# EAGLE design midihub_2 (EAGLE 5.10)

## Sheet 1 of 6
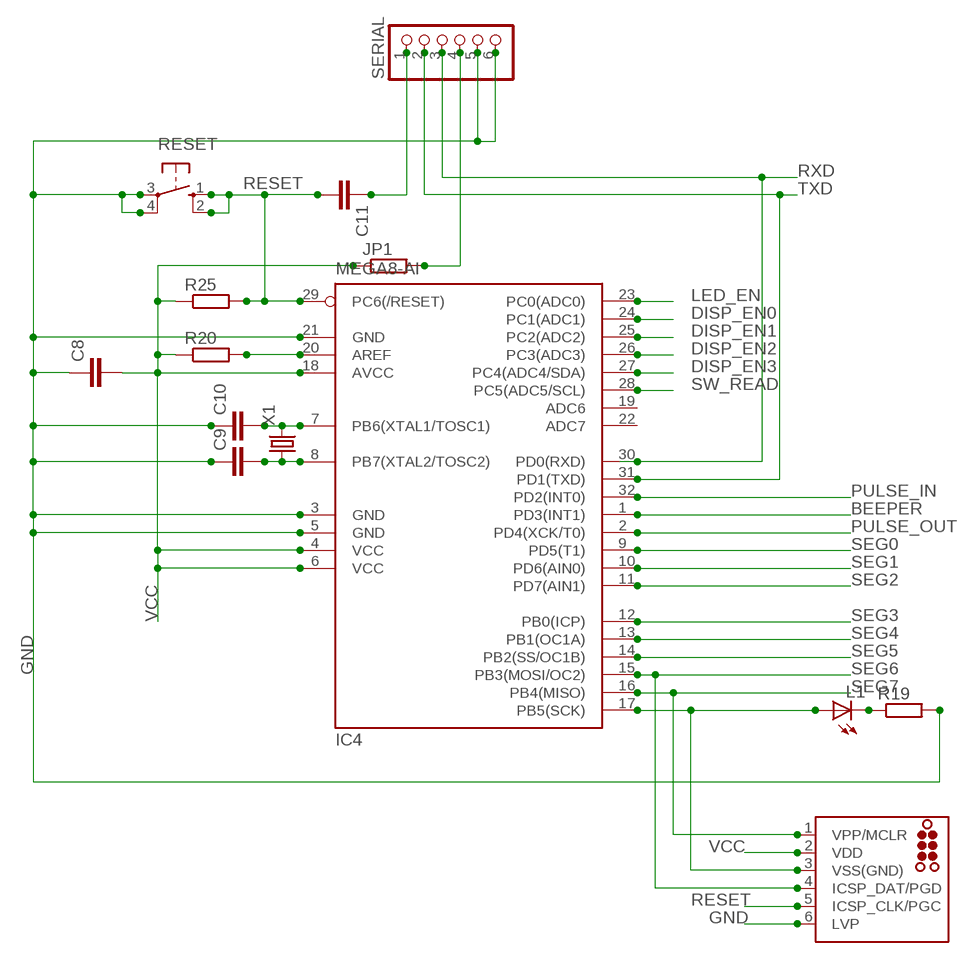
[diagram p0: schematic, sheet 1]

### Parts
C8  C-EUC0805  [C0805]
C9  C-EUC0805  [C0805]
C10  C-EUC0805  [C0805]
C11  C-EUC0805  [C0805]
IC4  MEGA8-AI  [TQFP32-08]
ICSP  TC2030-MCP-NL  [TC2030-MCP-NL]
JP1  R-EU_M0805  [M0805]
L1  LED3MM  [LED3MM]
R19  R-EU_M0805  [M0805]
R20  R-EU_M0805  [M0805]
R25  R-EU_M0805  [M0805]
RESET  10-XX  [B3F-10XX]
SERIAL  PINHD-1X6  [1X06]
X1  CRYSTALHC49S  [HC49/S]

### Nets
BEEPER: IC4.1(PD3(INT1)) ; also sheet 6
DISP_EN0: IC4.24(PC1(ADC1)) ; also sheet 3
DISP_EN1: IC4.25(PC2(ADC2)) ; also sheet 3
DISP_EN2: IC4.26(PC3(ADC3)) ; also sheet 3
DISP_EN3: IC4.27(PC4(ADC4/SDA)) ; also sheet 3
GND: C8.1 C9.1 C10.1 IC4.3(GND) IC4.5(GND) IC4.21(GND) ICSP.6(LVP) R19.2 RESET.3(P) RESET.4(P1) SERIAL.5 SERIAL.6 ; also sheet 2,3,4,5,6
LED_EN: IC4.23(PC0(ADC0)) ; also sheet 3
N$2: JP1.2 SERIAL.4
N$25: L1.K(C) R19.1
N$26: IC4.17(PB5(SCK)) ICSP.3(VSS(GND)) L1.A
N$33: C10.2 IC4.7(PB6(XTAL1/TOSC1)) X1.2
N$34: C9.2 IC4.8(PB7(XTAL2/TOSC2)) X1.1
N$35: IC4.20(AREF) R20.2
N$39: C11.1 SERIAL.1
PULSE_IN: IC4.32(PD2(INT0)) ; also sheet 4
PULSE_OUT: IC4.2(PD4(XCK/T0)) ; also sheet 4
RESET: C11.2 IC4.29(PC6(/RESET)) ICSP.5(ICSP_CLK/PGC) R25.2 RESET.1(S) RESET.2(S1)
RXD: IC4.30(PD0(RXD)) SERIAL.3 ; also sheet 2
SEG0: IC4.9(PD5(T1)) ; also sheet 3
SEG1: IC4.10(PD6(AIN0)) ; also sheet 3
SEG2: IC4.11(PD7(AIN1)) ; also sheet 3
SEG3: IC4.12(PB0(ICP)) ; also sheet 3
SEG4: IC4.13(PB1(OC1A)) ; also sheet 3
SEG5: IC4.14(PB2(SS/OC1B)) ; also sheet 3
SEG6: IC4.15(PB3(MOSI/OC2)) ICSP.4(ICSP_DAT/PGD) ; also sheet 3
SEG7: IC4.16(PB4(MISO)) ICSP.1(VPP/MCLR) ; also sheet 3
SW_READ: IC4.28(PC5(ADC5/SCL)) ; also sheet 3
TXD: IC4.31(PD1(TXD)) SERIAL.2 ; also sheet 2
VCC: C8.2 IC4.4(VCC) IC4.6(VCC) IC4.18(AVCC) ICSP.2(VDD) JP1.1 R20.1 R25.1 ; also sheet 2,4,5
Unconnected: IC4.19(ADC6) IC4.22(ADC7)

## Sheet 2 of 6
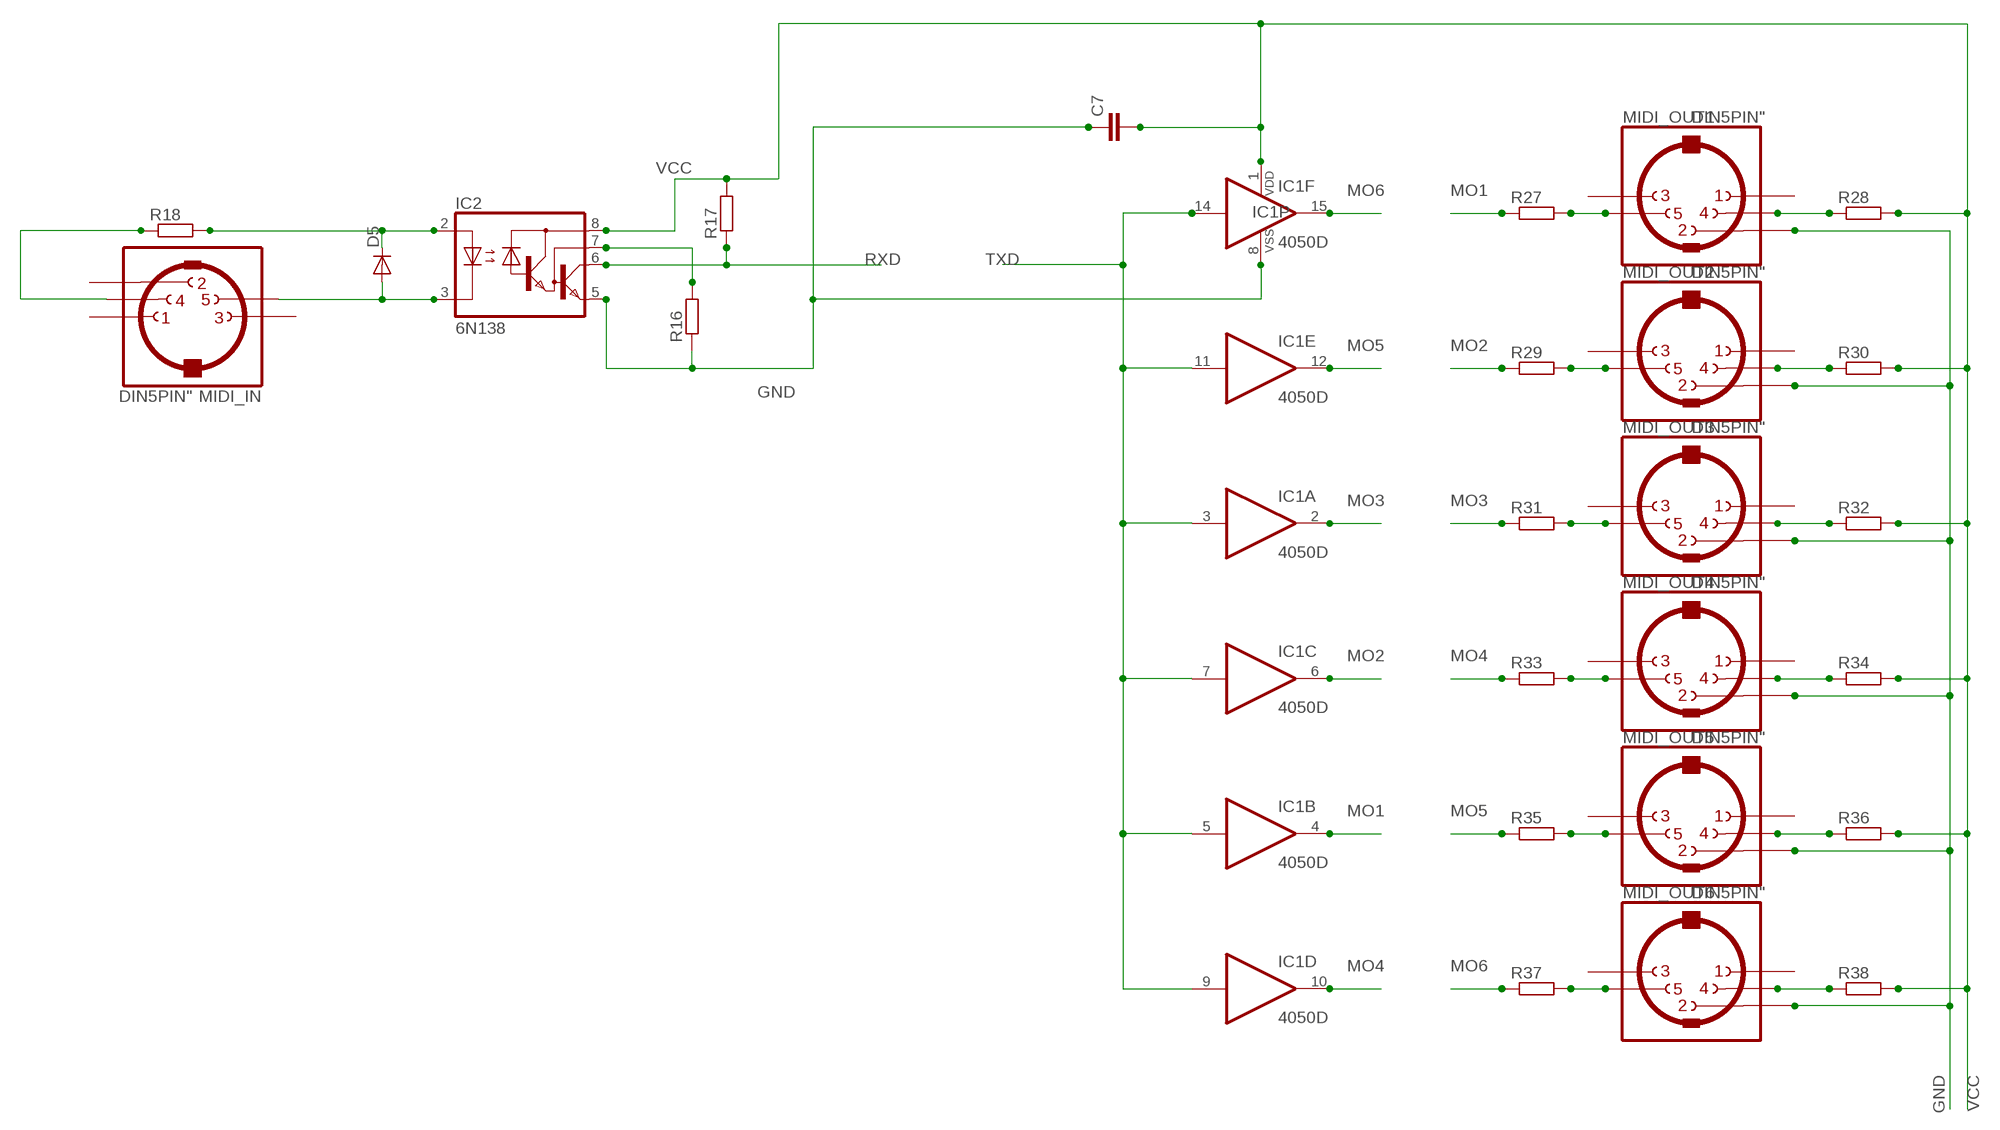
[diagram p1: schematic, sheet 2]

### Parts
C7  C-EUC0805  [C0805]
D5  DIODE-SOD80C  [SOD80C]
IC1  4050D  [SO16]
IC2  6N138  [DIL08]
MIDI_IN  DIN5PIN"  DIN5PINRAPIDDIN5  [RAPIDDIN5]
MIDI_OUT1  DIN5PIN"  DIN5PINRAPIDDIN5  [RAPIDDIN5]
MIDI_OUT2  DIN5PIN"  DIN5PINRAPIDDIN5  [RAPIDDIN5]
MIDI_OUT3  DIN5PIN"  DIN5PINRAPIDDIN5  [RAPIDDIN5]
MIDI_OUT4  DIN5PIN"  DIN5PINRAPIDDIN5  [RAPIDDIN5]
MIDI_OUT5  DIN5PIN"  DIN5PINRAPIDDIN5  [RAPIDDIN5]
MIDI_OUT6  DIN5PIN"  DIN5PINRAPIDDIN5  [RAPIDDIN5]
R16  R-EU_M0805  [M0805]
R17  R-EU_M0805  [M0805]
R18  R-EU_M0805  [M0805]
R27  R-EU_M0805  [M0805]
R28  R-EU_M0805  [M0805]
R29  R-EU_M0805  [M0805]
R30  R-EU_M0805  [M0805]
R31  R-EU_M0805  [M0805]
R32  R-EU_M0805  [M0805]
R33  R-EU_M0805  [M0805]
R34  R-EU_M0805  [M0805]
R35  R-EU_M0805  [M0805]
R36  R-EU_M0805  [M0805]
R37  R-EU_M0805  [M0805]
R38  R-EU_M0805  [M0805]

### Nets
GND: C7.1 IC1.8(P:VSS) IC2.5(GND) MIDI_OUT1.2 MIDI_OUT2.2 MIDI_OUT3.2 MIDI_OUT4.2 MIDI_OUT5.2 MIDI_OUT6.2 R16.1 ; also sheet 1,3,4,5,6
MO1: IC1.4(B:O) R27.1
MO2: IC1.6(C:O) R29.1
MO3: IC1.2(A:O) R31.1
MO4: IC1.10(D:O) R33.1
MO5: IC1.12(E:O) R35.1
MO6: IC1.15(F:O) R37.1
N$7: MIDI_OUT1.5 R27.2
N$8: MIDI_OUT2.5 R29.2
N$9: MIDI_OUT3.5 R31.2
N$10: MIDI_OUT4.5 R33.2
N$11: MIDI_OUT5.5 R35.2
N$12: MIDI_OUT6.5 R37.2
N$13: MIDI_OUT1.4 R28.1
N$14: MIDI_OUT2.4 R30.1
N$15: MIDI_OUT3.4 R32.1
N$16: MIDI_OUT4.4 R34.1
N$17: MIDI_OUT5.4 R36.1
N$18: MIDI_OUT6.4 R38.1
N$41: D5.A IC2.3(C) MIDI_IN.5
N$42: MIDI_IN.4 R18.1
N$43: D5.C IC2.2(A) R18.2
N$46: IC2.7(VB) R16.2
RXD: IC2.6(VO) R17.1 ; also sheet 1
TXD: IC1.3(A:I) IC1.5(B:I) IC1.7(C:I) IC1.9(D:I) IC1.11(E:I) IC1.14(F:I) ; also sheet 1
VCC: C7.2 IC1.1(P:VDD) IC2.8(VCC) R17.2 R28.2 R30.2 R32.2 R34.2 R36.2 R38.2 ; also sheet 1,4,5
Unconnected: MIDI_IN.1 MIDI_IN.2 MIDI_IN.3 MIDI_OUT1.1 MIDI_OUT1.3 MIDI_OUT2.1 MIDI_OUT2.3 MIDI_OUT3.1 MIDI_OUT3.3 MIDI_OUT4.1 MIDI_OUT4.3 MIDI_OUT5.1 MIDI_OUT5.3 MIDI_OUT6.1 MIDI_OUT6.3

## Sheet 3 of 6
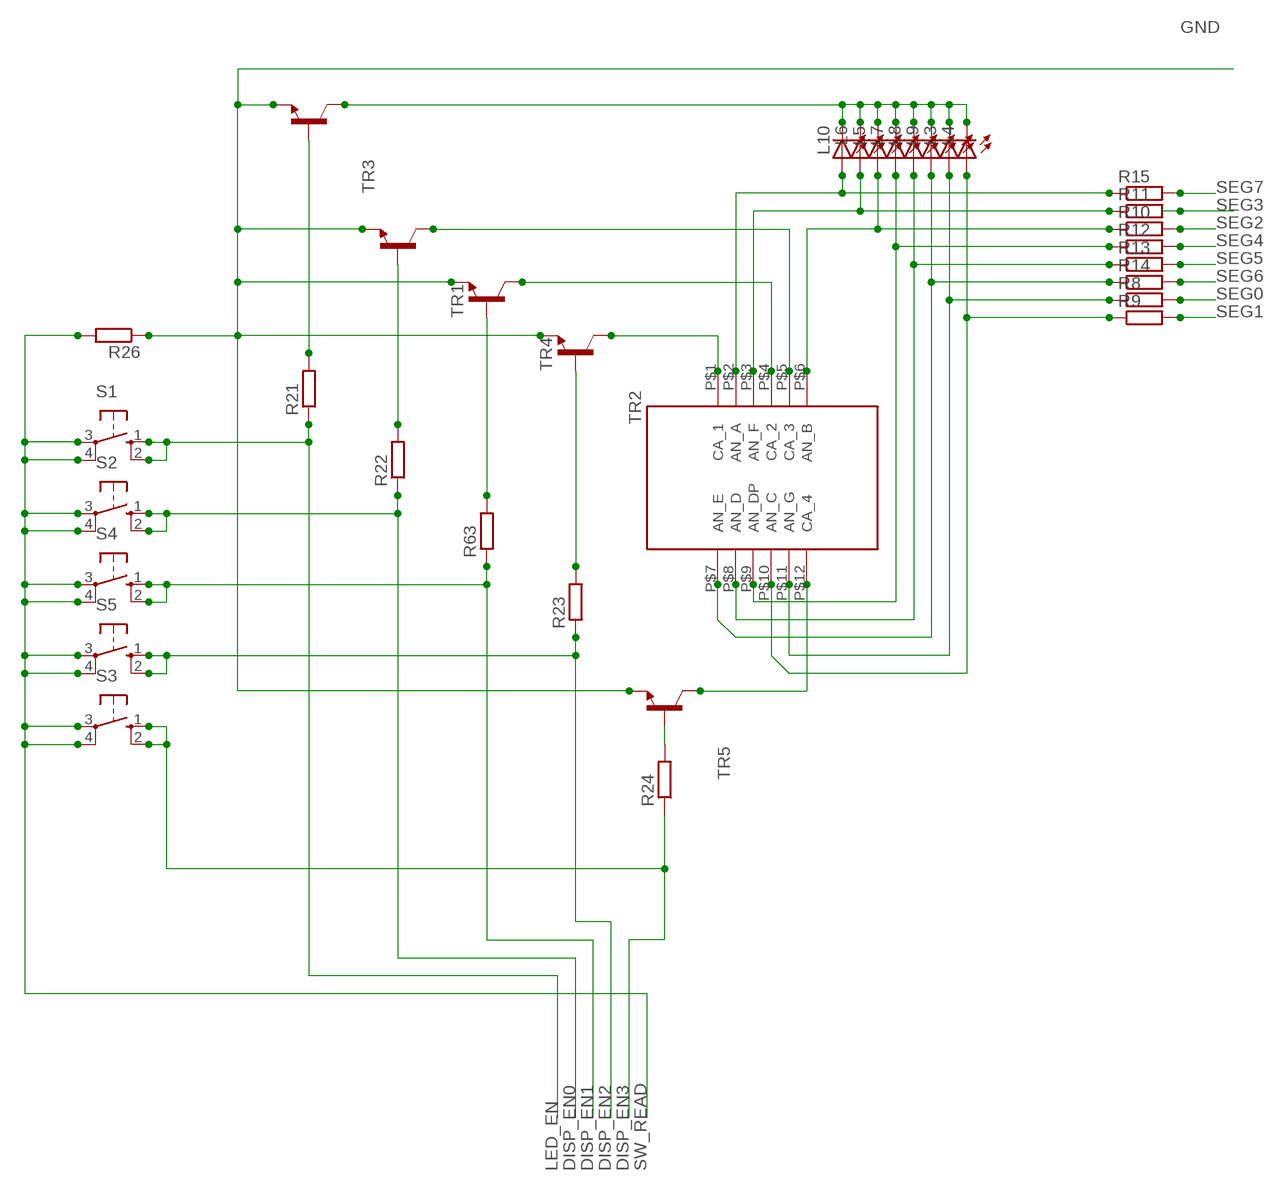
[diagram p2: schematic, sheet 3]

### Parts
DISP1  QUAD7SEG  [QUAD7SEG]
L3  LED3MM  [LED3MM]
L4  LED3MM  [LED3MM]
L5  LED3MM  [LED3MM]
L6  LED3MM  [LED3MM]
L7  LED3MM  [LED3MM]
L8  LED3MM  [LED3MM]
L9  LED3MM  [LED3MM]
L10  LED3MM  [LED3MM]
R8  R-EU_M0805  [M0805]
R9  R-EU_M0805  [M0805]
R10  R-EU_M0805  [M0805]
R11  R-EU_M0805  [M0805]
R12  R-EU_M0805  [M0805]
R13  R-EU_M0805  [M0805]
R14  R-EU_M0805  [M0805]
R15  R-EU_R0805  [R0805]
R21  R-EU_M0805  [M0805]
R22  R-EU_M0805  [M0805]
R23  R-EU_M0805  [M0805]
R24  R-EU_M0805  [M0805]
R26  R-EU_M0805  [M0805]
R63  R-EU_M0805  [M0805]
S1  40-XX  [B3F-40XX]
S2  40-XX  [B3F-40XX]
S3  40-XX  [B3F-40XX]
S4  40-XX  [B3F-40XX]
S5  40-XX  [B3F-40XX]
TR1  MMBT3904LT1-NPN-SOT23-BEC  [SOT23-BEC]
TR2  MMBT3904LT1-NPN-SOT23-BEC  [SOT23-BEC]
TR3  MMBT3904LT1-NPN-SOT23-BEC  [SOT23-BEC]
TR4  MMBT3904LT1-NPN-SOT23-BEC  [SOT23-BEC]
TR5  MMBT3904LT1-NPN-SOT23-BEC  [SOT23-BEC]

### Nets
DISP_EN0: R22.1 S2.1(S) S2.2(S1) ; also sheet 1
DISP_EN1: R63.1 S4.1(S) S4.2(S1) ; also sheet 1
DISP_EN2: R23.1 S5.1(S) S5.2(S1) ; also sheet 1
DISP_EN3: R24.1 S3.1(S) S3.2(S1) ; also sheet 1
GND: R26.1 TR1.E TR2.E TR3.E TR4.E TR5.E ; also sheet 1,2,4,5,6
LED_EN: R21.1 S1.1(S) S1.2(S1) ; also sheet 1
N$52: DISP1.P$2(AN_A) L10.A R15.1
N$53: DISP1.P$3(AN_F) L6.A R11.1
N$54: DISP1.P$6(AN_B) L5.A R10.1
N$55: DISP1.P$9(AN_DP) L7.A R12.1
N$56: DISP1.P$8(AN_D) L8.A R13.1
N$57: DISP1.P$7(AN_E) L9.A R14.1
N$58: DISP1.P$11(AN_G) L3.A R8.1
N$59: DISP1.P$10(AN_C) L4.A R9.1
N$60: L3.K(C) L4.K(C) L5.K(C) L6.K(C) L7.K(C) L8.K(C) L9.K(C) L10.K(C) TR3.C
N$61: DISP1.P$1(CA_1) TR2.C
N$62: DISP1.P$4(CA_2) TR4.C
N$63: DISP1.P$5(CA_3) TR1.C
N$64: DISP1.P$12(CA_4) TR5.C
N$65: R21.2 TR3.B
N$66: R22.2 TR1.B
N$67: R63.2 TR4.B
N$68: R23.2 TR2.B
N$74: R24.2 TR5.B
SEG0: R8.2 ; also sheet 1
SEG1: R9.2 ; also sheet 1
SEG2: R10.2 ; also sheet 1
SEG3: R11.2 ; also sheet 1
SEG4: R12.2 ; also sheet 1
SEG5: R13.2 ; also sheet 1
SEG6: R14.2 ; also sheet 1
SEG7: R15.2 ; also sheet 1
SW_READ: R26.2 S1.3(P) S1.4(P1) S2.3(P) S2.4(P1) S3.3(P) S3.4(P1) S4.3(P) S4.4(P1) S5.3(P) S5.4(P1) ; also sheet 1

## Sheet 4 of 6
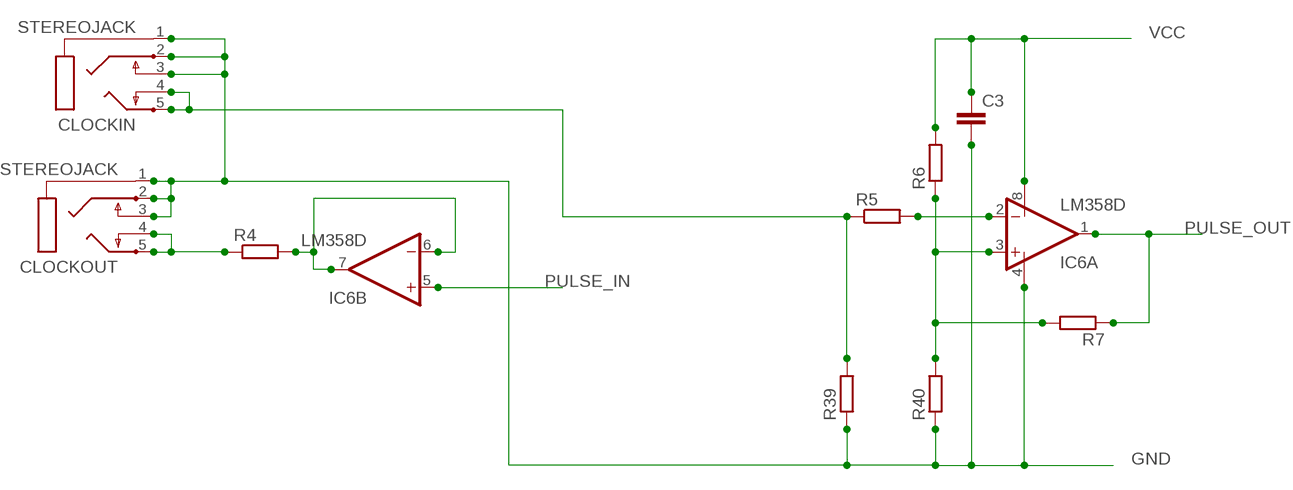
[diagram p3: schematic, sheet 4]

### Parts
C3  C-EUC0805  [C0805]
CLOCKIN  STEREOJACK  [STX3100]
CLOCKOUT  STEREOJACK  [STX3100]
IC6  LM358D  [SO08]
R4  R-EU_M0805  [M0805]
R5  R-EU_M0805  [M0805]
R6  R-EU_M0805  [M0805]
R7  R-EU_M0805  [M0805]
R39  R-EU_M0805  [M0805]
R40  R-EU_M0805  [M0805]

### Nets
GND: C3.2 CLOCKIN.1 CLOCKIN.2 CLOCKIN.3 CLOCKOUT.1 CLOCKOUT.2 CLOCKOUT.3 IC6.4(P:V-) R39.1 R40.1 ; also sheet 1,2,3,5,6
N$19: IC6.3(A:+IN) R6.1 R7.2 R40.2
N$21: IC6.2(A:-IN) R5.2
N$22: CLOCKIN.4 CLOCKIN.5 R5.1 R39.2
N$23: CLOCKOUT.4 CLOCKOUT.5 R4.1
N$24: IC6.6(B:-IN) IC6.7(B:OUT) R4.2
PULSE_IN: IC6.5(B:+IN) ; also sheet 1
PULSE_OUT: IC6.1(A:OUT) R7.1 ; also sheet 1
VCC: C3.1 IC6.8(P:V+) R6.2 ; also sheet 1,2,5

## Sheet 5 of 6
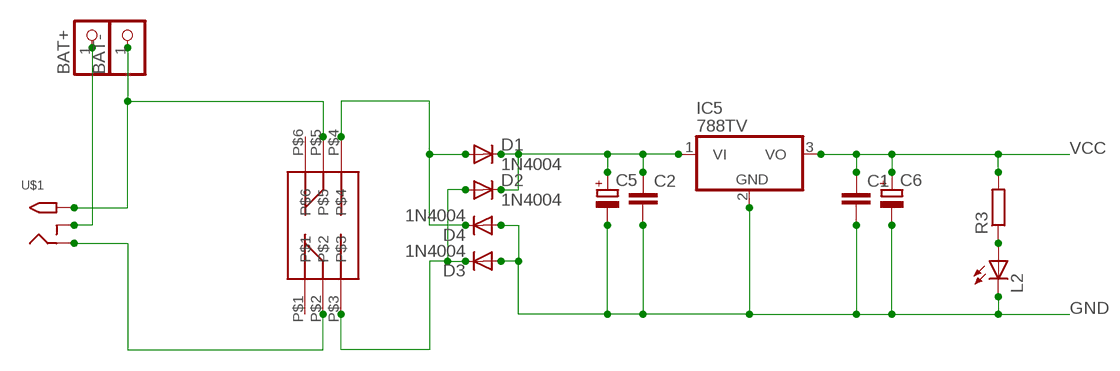
[diagram p4: schematic, sheet 5]

### Parts
BAT+  PINHD-1X1  [1X01]
BAT-  PINHD-1X1  [1X01]
C1  C-EUC0805  [C0805]
C2  C-EUC0805  [C0805]
C5  CPOL-EUE2.5-6  [E2,5-6]
C6  CPOL-EUE2.5-6  [E2,5-6]
D1  1N4004  [DO-VERT]
D2  1N4004  [DO-VERT]
D3  1N4004  [DO-VERT]
D4  1N4004  [DO-VERT]
IC5  788TV  [TO220V]
L2  LED3MM  [LED3MM]
R3  R-EU_M0805  [M0805]
U$1  2.1MMJACKTHM  [PJ-102A]
U$2  2P2T_LATCHING  [2P2T_LATCHING]

### Nets
GND: C1.2 C2.2 C5.- C6.- D3.A D4.A IC5.2(GND) L2.K(C) ; also sheet 1,2,3,4,6
N$1: BAT+.1 U$1.RING_SW
N$20: C2.1 C5.+ D1.C D2.C IC5.1(VI)
N$27: L2.A R3.1
N$28: BAT-.1 U$1.TIP U$2.P$5
N$29: D1.A D4.C U$2.P$4
N$30: D2.A D3.C U$2.P$3
N$31: U$1.RING U$2.P$2
VCC: C1.1 C6.+ IC5.3(VO) R3.2 ; also sheet 1,2,4
Unconnected: U$2.P$1 U$2.P$6

## Sheet 6 of 6
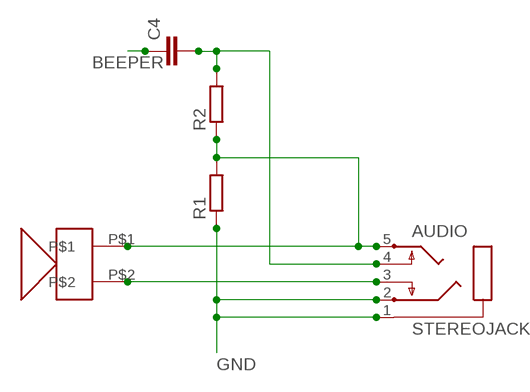
[diagram p5: schematic, sheet 6]

### Parts
AUDIO  STEREOJACK  [STX3100]
C4  C-EUC0805  [C0805]
R1  R-EU_M0805  [M0805]
R2  R-EU_M0805  [M0805]
U$3  THRUHOLEBEEPER  [THRUHOLEBEEPER]

### Nets
BEEPER: C4.1 ; also sheet 1
GND: AUDIO.1 AUDIO.2 R1.1 ; also sheet 1,2,3,4,5
N$36: AUDIO.5 R1.2 R2.1 U$3.P$1
N$37: AUDIO.4 C4.2 R2.2
N$40: AUDIO.3 U$3.P$2

## Library data of the parts
AUDIO CLOCKIN CLOCKOUT = adafruit:STEREOJACK: MIC/HEADPHONE JACK Stereo jack with two switches. Kycon STX3100, CUI SJ1-3555NG and/or 4UCon 05544
BAT+ BAT- = pinhead:PINHD-1X1: PIN HEADER
C1-C3 C7-C11 = rcl:C-EU: CAPACITOR, European symbol
C4 = resistor:C-EU: CAPACITOR, European symbol
C5 C6 = rcl:CPOL-EU: POLARIZED CAPACITOR, European symbol
D1-D4 = jasons_stuff:1N4004: DIODE general purpose rectifier, 1 A
D5 = diode:DIODE-: DIODE
DISP1 = jasons_stuff:QUAD7SEG
IC1 = 40xx:4050: Hex non-inverting BUFFER
IC2 = optocoupler:6N138: MOTOROLA OPTO COUPLER
IC4 = atmel:MEGA8: MICROCONTROLLER 8 Kbytes FLASH, 1 kbytes SRAM, 512 bytes EEPROM, USART, 6-channel 10 bit ADC, 2-channel 8 bit ADC Pin compatible with Atmega48, ATMega88, ATMega168 Source: avr.lbr
IC5 = linear:78*: Positive VOLTAGE REGULATOR Source: http://cache.national.com/ds/LM/LM78L05.pdf http://www.fairchildsemi.com/ds/LM/LM7805.pdf
IC6 = linear:LM358: OP AMP also LM158; LM258; LM2904 Source: http://cache.national.com/ds/LM/LM158.pdf
ICSP = tag-connect:TC2030: TAG-CONNECT ICSP Connector Manufacturer: Tag-Connect <http://www.tag-connect.com> Cable for easy In-Circuit Serial Programming. Designed for Microchip ICD2, suitable for many others. Two variants - one "with legs" (for hands-free fit on PCB) and another "without legs" for quick programming. PAD Description 1 MCLR/Vpp 2 Vdd 3 GND 4 PGD (ISPDAT) 5 PGC (ISPCLK) 6 nc (used for LVP) ©2009 ROFA.cz - modified and updated by Robert Darlington ‹rdarlington@gmail.com›
JP1 R3-R40 R63 = rcl:R-EU_: RESISTOR, European symbol
L1-L10 = adafruit:LED: LED OSRAM: - CHIPLED LG R971, LG N971, LY N971, LG Q971, LY Q971, LO R971, LY R971 LH N974, LH R974 LS Q976, LO Q976, LY Q976 LO Q996 - Hyper CHIPLED LW Q18S LB Q993, LB Q99A, LB R99A - SideLED LS A670, LO A670, LY A670, LG A670, LP A670 LB A673, LV A673, LT A673, LW A673 LH A674 LY A675 LS A676, LA A676, LO A676, LY A676, LW A676 LS A679, LY A679, LG A679 - Hyper Micro SIDELED® LS Y876, LA Y876, LO Y876, LY Y876 LT Y87S - SmartLED LW L88C, LW L88S LB L89C, LB L89S, LG L890 LS L89K, LO L89K, LY L89K LS L896, LA L896, LO L896, LY L896 - TOPLED LS T670, LO T670, LY T670, LG T670, LP T670 LSG T670, LSP T670, LSY T670, LOP T670, LYG T670 LG T671, LOG T671, LSG T671 LB T673, LV T673, LT T673, LW T673 LH T674 LS T676, LA T676, LO T676, LY T676, LB T676, LH T676, LSB T676, LW T676 LB T67C, LV T67C, LT T67C, LS T67K, LO T67K, LY T67K, LW E67C LS E67B, LA E67B, LO E67B, LY E67B, LB E67C, LV E67C, LT E67C LW T67C LS T679, LY T679, LG T679 LS T770, LO T770, LY T770, LG T770, LP T770 LB T773, LV T773, LT T773, LW T773 LH T774 LS E675, LA E675, LY E675, LS T675 LS T776, LA T776, LO T776, LY T776, LB T776 LHGB T686 LT T68C, LB T68C - Hyper Mini TOPLED® LB M676 - Mini TOPLED Santana® LG M470 LS M47K, LO M47K, LY M47K Source: http://www.osram.convergy.de/
MIDI_IN MIDI_OUT1-MIDI_OUT6 = jasons_stuff:DIN5PIN: Female CONNECTOR 5 pins 90 deg. with shield, horizontal (DIN 41524)
R1 R2 = resistor:R-EU_: RESISTOR, European symbol
RESET = switch-omron:10-XX: OMRON SWITCH
S1-S5 = switch-omron:40-XX: OMRON SWITCH
SERIAL = pinhead:PINHD-1X6: PIN HEADER
TR1-TR5 = transistor-neu-to92:*-NPN-: NPN Transistror
U$1 = adafruit:2.1MMJACK: 2.1mm x 5.5mm THM DC jack with internal switch. Digikey part #PJ-102A, 4UCON part #05537 2.1mm x 5.5mm SMT DC jack with internal switch. Digikey part #PJ-002A-SMT, 4UCON part #03267 By microbuilder.eu & adafruit.com
U$2 = jasons_stuff:2P2T_LATCHING
U$3 = jasons_stuff:THRUHOLEBEEPER
X1 = crystal:CRYSTAL: CRYSTAL

## Board
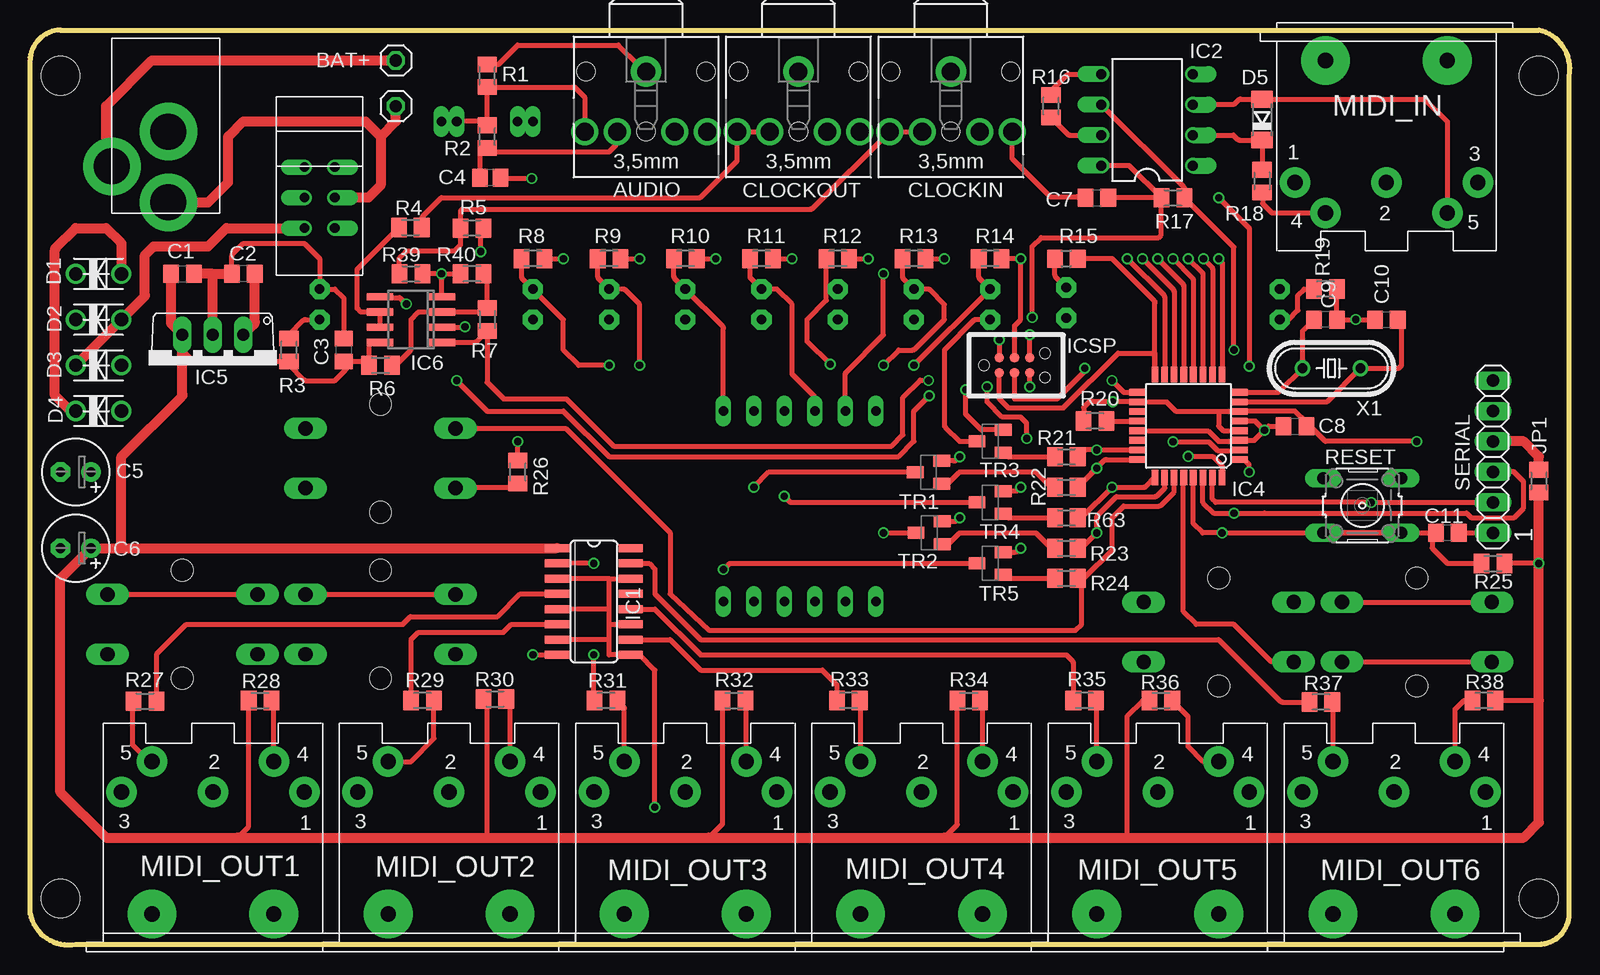
[diagram p6: board, top side]
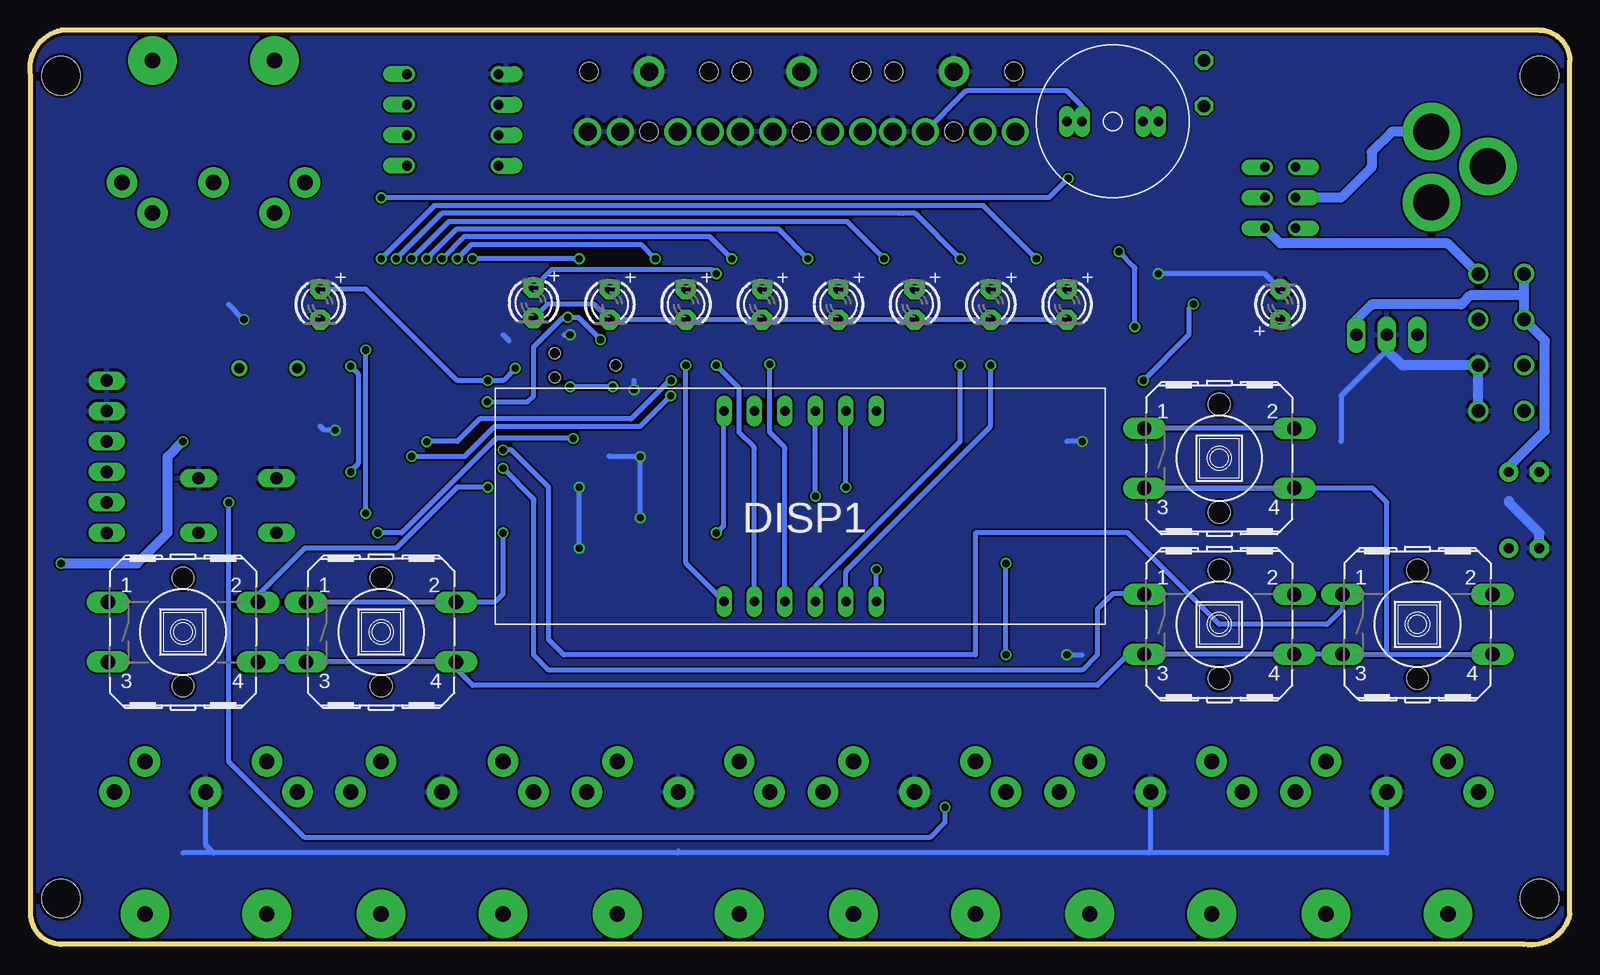
[diagram p7: board, bottom side, seen from below]

Size 128.32 x 76.25 mm. Coordinates in mm from the lower left corner, seen from the top.
Outline: 0,2.59 0,73.71 arc-87 2.54,76.25 125.73,76.25 arc-87 128.27,72.44 128.27,2.59 arc-87 125.73,0.05 3.81,0.05 arc-87 0,2.59
Copper layers (1*16): Top 0.035mm / dielectric 1.5mm / Bottom 0.035mm
Design rules "ITEADstudio_DRC": minimum track width 6mil, minimum drill 12mil, track to track 6mil, track to pad 6mil, pad to pad 6mil, via to via 6mil, smd to smd 0mil, copper to edge 10mil, drill to drill 10mil, minimum pad ring 10mil, minimum via ring 6mil, stop-mask expansion 2mil, vias tented up to drill 100mil, thermal gap 10mil
Holes 3.2 mm at 2.54,3.86 125.73,3.86 2.54,72.44 125.73,72.44

### Footprints (pad centres in the part's own frame; a part is rotated, then mirrored left to right if it is on the bottom)
STX3100 = drill 1.5 pad 2.54 round: 1 2.7,-0.1 | drill 1.5 round: 2 7.7,5; 3 7.7,2.3; 4 7.7,-2.5; 5 7.7,-5.2 | hole 1.5: 2.7,4.9; 2.7,-5.1; 7.7,-0.1
1X01 = drill 1.016 octagon: 1 0,0
C0805 = smd 1.3 x 1.5: 1 -0.95,0; 2 0.95,0
C0805' = smd 1.3 x 1.5: 1 -0.85,0; 2 0.85,0
E2,5-6 = drill 0.813 pad 1.6 round: + -1.27,0 | drill 0.813 pad 1.6 octagon: - 1.27,0
DO-VERT = drill 1.118 round: A 2.54,0; C -1.27,0
SOD80C = smd 1.4 x 1.8: A 1.7,0; C -1.7,0
QUAD7SEG = drill 0.8 long: P$1 -6.35,8.89; P$2 -3.81,8.89; P$3 -1.27,8.89; P$4 1.27,8.89; P$5 3.81,8.89; P$6 6.35,8.89; P$7 -6.35,-6.985; P$8 -3.81,-6.985; P$9 -1.27,-6.985; P$10 1.27,-6.985; P$11 3.81,-6.985; P$12 6.35,-6.985
SO16 = smd 0.66 x 2.032: 1 -4.445,-3.073; 2 -3.175,-3.073; 3 -1.905,-3.073; 4 -0.635,-3.073; 5 0.635,-3.073; 6 1.905,-3.073; 7 3.175,-3.073; 8 4.445,-3.073; 9 4.445,3.073; 10 3.175,3.073; 11 1.905,3.073; 12 0.635,3.073; 13 -0.635,3.073; 14 -1.905,3.073; 15 -3.175,3.073; 16 -4.445,3.073
DIL08 = drill 0.813 offset: 1 -3.81,-3.81; 2 -1.27,-3.81; 3 1.27,-3.81; 4 3.81,-3.81; 5 3.81,3.81; 6 1.27,3.81; 7 -1.27,3.81; 8 -3.81,3.81
TQFP32-08 = smd 1.27 x 0.559: 1 -4.293,2.8; 2 -4.293,2; 3 -4.293,1.2; 4 -4.293,0.4; 5 -4.293,-0.4; 6 -4.293,-1.2; 7 -4.293,-2; 8 -4.293,-2.8; 17 4.293,-2.8; 18 4.293,-2; 19 4.293,-1.2; 20 4.293,-0.4; 21 4.293,0.4; 22 4.293,1.2; 23 4.293,2; 24 4.293,2.8 | smd 0.559 x 1.27: 9 -2.8,-4.293; 10 -2,-4.293; 11 -1.2,-4.293; 12 -0.4,-4.293; 13 0.4,-4.293; 14 1.2,-4.293; 15 2,-4.293; 16 2.8,-4.293; 25 2.8,4.293; 26 2,4.293; 27 1.2,4.293; 28 0.4,4.293; 29 -0.4,4.293; 30 -1.2,4.293; 31 -2,4.293; 32 -2.8,4.293
TO220V = drill 1.016 long: 1 -2.54,-2.54; 2 0,-2.54; 3 2.54,-2.54
SO08 = smd 0.6 x 2.2: 1 -1.905,-2.6; 2 -0.635,-2.6; 3 0.635,-2.6; 4 1.905,-2.6; 5 1.905,2.6; 6 0.635,2.6; 7 -0.635,2.6; 8 -1.905,2.6
TC2030-MCP-NL = smd 0.787 x 0.787: 1 1.27,-0.635; 2 1.27,0.635; 3 2.54,-0.635; 4 2.54,0.635; 5 3.81,-0.635; 6 3.81,0.635 | hole 0.889: 0,0; 5.08,-1.016; 5.08,1.016
M0805 = smd 1.3 x 1.6: 1 -0.95,0; 2 0.95,0
LED3MM = drill 0.813 pad 1.676 octagon: A -1.27,0; K 1.27,0
RAPIDDIN5 = drill 1.27 pad 2.54 round: 1 7.62,5.08; 2 0,5.08; 3 -7.62,5.08; 4 5.08,7.62; 5 -5.08,7.62 | drill 1.27 pad 4.064 round: NC -5.08,-5.08; NC@ 5.08,-5.08
R0805 = smd 1.3 x 1.5: 1 -0.95,0; 2 0.95,0
B3F-10XX = drill 1.016 long: 1 -3.251,2.261; 2 3.251,2.261; 3 -3.251,-2.261; 4 3.251,-2.261
B3F-40XX = drill 1.194 long: 1 -6.248,2.489; 2 6.248,2.489; 3 -6.248,-2.489; 4 6.248,-2.489 | hole 1.803: 0,-4.496; 0,4.496
1X06 = drill 1.016 long: 1 -6.35,0; 2 -3.81,0; 3 -1.27,0; 4 1.27,0; 5 3.81,0; 6 6.35,0
SOT23-BEC = smd 1 x 1.4: B -0.95,-1.1; C 0,1.1; E 0.95,-1.1
PJ-102A = drill 3 pad 4.8 round: RING 0.1,-3.39; RING_SW -4.6,-6.29; TIP 0.1,-9.29
2P2T_LATCHING = drill 0.8 offset: P$1 -1.27,0; P$2 -1.27,-2.54; P$3 -1.27,-5.08; P$4 1.27,-5.08; P$5 1.27,-2.54; P$6 1.27,0
THRUHOLEBEEPER = drill 0.8 long: P$1 0,2.54; P$2 0,-2.54; P$3 0,3.81; P$4 0,-3.81
HC49/S = drill 0.813 round: 1 -2.413,0; 2 2.413,0

### Placement (x,y rotation side)
AUDIO  51.44,75.49 270 top
BAT+  30.48,73.71 0 top
BAT-  30.48,69.9 0 top
C1  12.7,55.93 0 top
C2  17.78,55.93 180 top
C3  26.16,49.58 90 top
C4  [C0805']  38.35,63.93 180 top
C5  3.81,39.42 180 top
C6  3.81,33.07 180 top
C7  88.9,62.28 0 top
C8  105.41,43.23 0 top
C9  107.95,52.12 180 top
C10  113.03,52.12 0 top
C11  118.11,34.34 180 top
CLOCKIN  76.84,75.49 270 top
CLOCKOUT  64.14,75.49 270 top
D1  5.08,55.93 0 top
D2  5.08,52.12 0 top
D3  5.08,48.31 0 top
D4  5.08,44.5 0 top
D5  102.67,68.78 90 top
DISP1  64.14,35.61 0 bottom
IC1  46.99,28.62 270 top
IC2  93.09,68.76 90 top
IC4  96.55,43.25 180 top
IC5  15.24,48.31 180 top
IC6  31.75,52.12 90 top
ICSP  79.5,48.31 0 top
JP1  125.73,38.66 90 top
L1  104.14,53.39 270 bottom
L2  24.13,53.39 90 bottom
L3  41.91,53.39 270 bottom
L4  48.26,53.39 270 bottom
L5  54.61,53.39 270 bottom
L6  60.96,53.39 270 bottom
L7  67.31,53.39 270 bottom
L8  73.66,53.39 270 bottom
L9  80.01,53.39 270 bottom
L10  86.36,53.52 270 bottom
MIDI_IN  113.03,68.63 180 top
MIDI_OUT1  15.24,7.67 0 top
MIDI_OUT2  34.92,7.67 0 top
MIDI_OUT3  54.61,7.67 0 top
MIDI_OUT4  74.3,7.67 0 top
MIDI_OUT5  93.98,7.67 0 top
MIDI_OUT6  113.67,7.67 0 top
R1  38.1,72.44 270 top
R2  38.1,67.36 270 top
R3  21.59,49.58 270 top
R4  31.7,59.79 180 top
R5  36.83,59.74 0 top
R6  29.21,48.31 180 top
R7  38.1,52.12 90 top
R8  41.91,57.2 0 top
R9  48.26,57.2 0 top
R10  54.61,57.2 0 top
R11  60.96,57.2 0 top
R12  67.31,57.2 0 top
R13  73.66,57.2 0 top
R14  80.01,57.2 0 top
R15  86.36,57.2 0 top
R16  85.09,69.9 270 top
R17  95.25,62.28 180 top
R18  102.67,63.65 90 top
R19  107.95,54.66 0 top
R20  88.75,43.66 0 top
R21  86.36,40.69 180 top
R22  86.36,38.15 180 top
R23  86.36,33.07 180 top
R24  86.36,30.55 180 top
R25  121.92,31.8 180 top
R26  40.64,39.42 270 top
R27  9.58,20.32 180 top
R28  19.18,20.37 180 top
R29  32.72,20.37 0 top
R30  38.73,20.5 180 top
R31  48.01,20.37 0 top
R32  58.67,20.37 180 top
R33  68.2,20.37 0 top
R34  78.23,20.37 180 top
R35  87.88,20.37 0 top
R36  94.23,20.37 180 top
R37  107.57,20.24 0 top
R38  121.16,20.37 0 top
R39  31.75,55.93 180 top
R40  36.83,55.93 0 top
R63  86.36,35.61 180 top
RESET  111.02,36.63 180 top
S1  12.7,26.72 0 bottom
S2  29.21,26.72 0 bottom
S3  29.21,40.56 0 bottom
S4  115.57,26.08 0 bottom
S5  99.06,26.08 0 bottom
SERIAL  121.92,40.69 90 top
TR1  74.88,39.39 90 top
TR2  74.93,34.36 90 top
TR3  80.01,41.98 90 top
TR4  80.01,36.88 90 top
TR5  80.01,31.8 90 top
U$1  11.43,71.17 0 top
U$2  24.13,64.82 0 top
U$3  38.1,68.63 270 bottom
X1  108.46,48.06 0 top

### Tracks (layer width: path | path; a pad name or v marks a point on that pad's centre or on a via)
BEEPER  (via drill 0.6)
  Top 0.406: C4.1 39.26,63.88 v41.81,63.88 | v99.06,62.28 101.6,59.74 v101.6,48.23 | v101.6,39.42 101.6,40.03 101.17,40.45 IC4.1
  Bottom 0.406: v41.81,63.88 43.41,62.28 v99.06,62.28 | v101.6,48.23 100.97,47.6 100.97,40.11 101.6,39.47 v101.6,39.42
DISP_EN0  (via drill 0.6)
  Top 0.406: IC4.24 89.72,40.45 arc45 89.54,40.38 R22.1 88.89,39.72 v88.9,39.72 | S2.2 S2.1
  Bottom 0.406: S2.1 35.51,29.26 38.1,29.26 39.37,27.99 39.37,24.18 40.64,22.91 85.09,22.91 86.36,24.18 86.36,36.88 86.34,36.9 86.34,37.16 v88.9,39.72
DISP_EN1  (via drill 0.6)
  Top 0.406: R63.1 87.53,35.61 arc45 87.7,35.68 v90.17,38.15 92.83,38.15 arc45 93.01,38.22 IC4.25 | S4.2 S4.1
  Bottom 0.406: S4.2 109.32,29.16 105.41,33.07 97.79,33.07 92.71,38.15 v90.17,38.15
DISP_EN2  (via drill 0.6)
  Top 0.406: R23.1 87.53,33.07 arc45 87.7,33.14 v88.9,34.34 88.9,35.63 arc-45 88.97,35.81 90.53,37.36 93.75,37.36 arc45 93.93,37.44 94.56,38.07 94.56,38.92 arc45 IC4.26
  Bottom 0.406: v88.9,34.34 88.9,29.26 89.59,28.57 S5.2 S5.1
DISP_EN3
  Top 0.406: IC4.27 arc-45 95.35,38.95 95.35,37.74 94.26,36.65 arc-45 94.08,36.57 91.14,36.57 90.17,35.61 90.17,32.89 87.91,30.63 arc-45 87.73,30.55 R24.1 87.63,30.23 87.63,26.72 87.12,26.21 56.62,26.21 53.34,29.26 53.34,34.34 44.63,43.05 S3.1
  Bottom 0.406: S3.2 S3.1
GND  (via drill 0.6)
  Top 0.406: v34.29,55.93 R40.1 | v34.29,55.93 34.29,54.17 arc45 IC6.4 | C3.2 26.16,53.79 arc45 26.09,53.97 25.4,54.66 L2.K 24.13,57.2 22.93,58.4 arc45 22.75,58.47 17.78,58.47 16.9,57.59 arc45 16.83,57.41 C2.2 | AUDIO.1 50.81,73.32 arc45 50.63,73.39 49.04,74.98 40.64,74.98 39.05,73.39 R1.1 | C7.1 87.45,62.28 arc-45 87.27,62.35 85.02,62.35 81.84,65.53 CLOCKIN.2 | IC2.5 86.59,72.57 arc45 86.41,72.49 85.09,71.17 R16.1 | v34.29,55.93 R39.1 | TR2.E 77.07,35.31 arc45 77.25,35.39 v77.47,35.61 | TR1.E 77.02,40.34 arc45 77.2,40.42 v77.47,40.69 | TR4.E 82.12,37.83 arc45 82.3,37.9 v82.55,38.15 | TR5.E 82.12,32.75 arc45 82.3,32.82 v82.55,33.07 | IC4.5 102.11,43.65 v102.87,42.9 | v102.87,42.9 102.03,42.05 IC4.3 100.74,41.96 99.06,41.96 98.17,42.85 92.26,42.85 IC4.21 | C8.1 103.2,43.23 v102.87,42.9 | v41.91,24.18 IC1.8 | R26.1 v40.64,41.96 | R19.2 C9.1 v110.49,52.12 C10.1 | TR3.E 79.29,42.93 77.98,44.25 v77.98,46.28 | ICSP.6 v83.31,50.85
  Top 0.813: 15.24,55.93 C1.2 | 15.24,55.93 C2.2 | IC5.2 15.24,55.93
  Bottom 0.406: MIDI_OUT1.2 15.24,7.67 35.05,7.67 | MIDI_OUT6.2 113.67,8.41 arc-45 113.59,8.23 113.03,7.67 | 35.05,7.67 74.37,7.67 | 74.37,7.67 113.03,7.67 | 74.3,7.85 arc45 74.37,7.67 | MIDI_OUT2.2 34.92,7.9 arc45 35,7.72 35.05,7.67 | v34.29,55.93 25.5,55.93 arc45 25.33,55.86 L2.K | v77.47,35.61 v77.47,40.69 79.91,40.69 arc45 80.08,40.76 | v82.55,33.07 v82.55,38.15 | 19.05,41.96 19.05,45.77 15.24,49.58 | v102.87,42.9 103.81,42.9 104.14,43.23 | v41.91,24.18 40.64,24.18 | 113.03,7.67 115.57,7.67 | v40.64,41.96 41.91,41.96 | v110.49,52.12 111.76,53.39 | 88.39,50.34 88.9,50.85 | v77.98,46.28 77.98,47.04 | v83.31,50.85 83.82,50.85
  Bottom 0.813: D4.A D3.A 13.86,48.31 arc45 14.04,48.38 15.24,49.58 IC5.2 | 5.08,36.98 arc-45 5.01,36.81 2.54,34.34 C6.-
  pour Bottom: -1.27,76.25 -1.27,0.05 128.27,0.05 128.27,76.25
LED_EN  (via drill 0.6)
  Top 0.406: R21.1 87.8,41.18 arc-45 87.98,41.25 v88.9,41.25 IC4.23 | S1.2 S1.1
  Bottom 0.406: S1.1 18.95,27.99 20.22,26.72 29.21,26.72 36.83,34.34 49.53,34.34 49.53,24.18 83.82,24.18 85.09,25.45 85.09,38.15 88.2,41.25 v88.9,41.25
MO1
  Top 0.406: IC1.4 40.87,29.26 38.96,27.35 31.7,27.35 31.06,26.72 15.24,26.72 13.97,26.72 13.03,26.72 10.57,24.26 10.57,20.36 R27.1
MO2
  Top 0.406: IC1.6 40.11,26.72 39.45,26.06 32.36,26.06 31.73,25.43 31.77,25.4 R29.1
MO3  (via drill 0.6)
  Top 0.406: v46.99,31.8 IC1.2 | v46.99,24.18 46.99,20.44 R31.1
  Bottom 0.406: v46.99,24.18 v46.99,31.8
MO4
  Top 0.406: R33.1 67.25,21.7 66.04,22.91 55.88,22.91 53.34,25.45 IC1.10
MO5
  Top 0.406: R35.1 86.93,23.5 arc45 86.86,23.68 86.36,24.18 55.88,24.18 52.07,27.99 IC1.12
MO6
  Top 0.406: R37.1 104.37,20.24 arc-45 104.19,20.32 99.06,25.45 55.88,25.45 52.07,29.26 52.07,31.32 51.59,31.8 50.98,31.8 50.95,31.82 50.14,31.82 50.09,31.77 IC1.15
N$1
  Top 0.813: BAT+.1 10.16,73.71 6.35,69.9 6.35,65.36 U$1.RING_SW
N$2
  Top 0.813: JP1.2 125.73,40.69 124.46,41.96 SERIAL.4
N$7
  Top 0.406: R27.2 8.56,20.25 8.56,16.69 9.96,15.29 MIDI_OUT1.5
N$8
  Top 0.406: MIDI_OUT2.5 31.75,15.29 33.66,17.2 R29.2
N$9
  Top 0.406: MIDI_OUT3.5 49.53,19.69 arc45 49.46,19.87 R31.2
N$10
  Top 0.406: MIDI_OUT4.5 69.22,20.21 arc45 R33.2
N$11
  Top 0.406: MIDI_OUT5.5 88.9,20.21 arc45 R35.2
N$12
  Top 0.406: MIDI_OUT6.5 108.59,20.08 arc45 R37.2
N$13
  Top 0.406: MIDI_OUT1.4 20.32,20.18 R28.1
N$14
  Top 0.406: MIDI_OUT2.4 40.01,20.07 arc45 39.93,20.25 R30.1
N$15
  Top 0.406: MIDI_OUT3.4 59.69,20.21 arc45 R32.1
N$16
  Top 0.406: MIDI_OUT4.4 79.38,20.07 arc45 79.3,20.25 R34.1
N$17
  Top 0.406: R36.1 96.52,19.03 96.52,16.56 97.79,15.29 MIDI_OUT5.4
N$18
  Top 0.406: MIDI_OUT6.4 118.77,15.31 118.77,19.66 119.48,20.37 R38.1
N$19
  Top 0.406: R40.2 38.03,55.68 arc-45 38.1,55.5 R7.2 37.86,52.83 arc-45 37.68,52.75 IC6.3 32.49,52.75 arc45 32.31,52.68 31.75,52.12 31.75,49.68 arc-45 31.68,49.51 30.48,48.31 R6.1
N$20
  Top 0.813: C2.1 18.73,51.9 arc-45 18.66,51.73 IC5.1
  Bottom 0.813: 3.81,53.9 D2.C 2.08,50.39 2.08,42.85 5.08,39.85 C5.+ | 3.81,53.9 D1.C | IC5.1 17.78,52.12 16.58,53.32 arc45 16.41,53.39 9.12,53.39 arc-45 8.94,53.46 8.28,54.13 4.14,54.13 arc45 3.96,54.05 3.81,53.9
N$21  (via drill 0.6)
  Top 0.406: IC6.2 36.19,51.48 arc45 v36.25,51.51 | v37.57,57.78 37.57,59.42 arc-45 37.64,59.6 R5.2
  Bottom 0.406: v36.25,51.51 36.25,56.36 arc-45 36.32,56.54 v37.57,57.78
N$22
  Top 0.406: R39.2 arc-45 30.79,55.97 30.79,57.25 31.29,57.76 arc-45 31.47,57.83 35.38,57.83 35.81,58.26 arc45 35.88,58.44 R5.1 35.88,61.07 arc-45 35.95,61.25 36.02,61.31 65.06,61.31 arc45 65.24,61.39 CLOCKIN.5 CLOCKIN.4
N$23
  Top 0.406: R4.1 32.65,60.53 arc-45 32.72,60.71 34.29,62.28 55.77,62.28 arc45 55.95,62.35 58.86,65.26 arc45 58.94,65.44 CLOCKOUT.5 CLOCKOUT.4
N$24
  Top 0.406: IC6.7 IC6.6 27.66,52.75 arc-45 27.48,52.83 27.25,53.06 27.25,56.19 arc-45 27.33,56.37 R4.2
N$25
  Top 0.406: L1.K 104.9,52.12 105.66,52.88 105.66,54.15 106.17,54.66 R19.1
N$26  (via drill 0.6)
  Top 0.406: v90.17,47.04 91.16,46.05 IC4.17 | ICSP.3 82.04,45.52 85.6,45.52 87.88,47.8 v87.88,48.06
  Bottom 0.406: L1.A 100.33,54.66 92.71,47.04 v90.17,47.04 88.9,47.04 v87.88,48.06
N$27
  Top 0.406: L2.A 22.96,52.12 arc45 22.79,52.05 21.59,50.85 R3.1
N$28
  Top 0.813: U$1.TIP 14.73,61.88 arc45 14.91,61.95 16.51,63.55 16.51,67.25 arc-45 16.58,67.43 17.78,68.63 27.84,68.63 arc-45 28.01,68.56 29.21,67.36 | BAT-.1 30.48,68.63 29.21,67.36 | U$2.P$5 28.19,62.28 29.21,63.3 29.21,67.36
N$29
  Top 0.813: D4.C 3.48,44.5 arc-45 3.3,44.57 2.08,45.79 2.08,57.91 arc-45 2.16,58.09 3.81,59.74 6.35,59.74 7.55,58.54 arc-45 7.62,58.36 D1.A
  Bottom 0.813: U$2.P$4 25.4,59.84 arc-45 25.33,59.67 24.13,58.47 10.27,58.47 arc45 10.09,58.4 D1.A
N$30
  Top 0.813: D3.C D2.A 9.5,54 arc45 9.58,54.18 9.58,57.48 10.24,58.14 arc-45 10.42,58.22 14.83,58.22 16.36,59.74 U$2.P$3
N$31
  Bottom 0.813: U$1.RING 14.71,67.78 arc-45 14.89,67.71 16.51,66.09 16.51,64.92 arc45 16.58,64.75 19.05,62.28 U$2.P$2
N$33
  Top 0.406: IC4.7 107.97,45.25 arc45 108.15,45.33 X1.2 114.05,48.06 114.3,48.31 114.3,51.8 C10.2
N$34
  Top 0.406: IC4.8 103.94,46.05 arc45 104.12,46.13 X1.1 106.05,51.16 106.21,51.32 C9.2
N$35
  Top 0.406: IC4.20 R20.2
N$36
  Top 0.406: U$3.P$1 37.67,68.63 arc-45 37.85,68.56 R2.1 R1.2 45.3,71.49 arc-45 45.47,71.42 46.16,70.73 arc-45 46.23,70.55 AUDIO.5
N$37
  Top 0.406: C4.2 37.5,65.71 arc-45 37.58,65.89 R2.2 38.1,66.09 48.26,66.09 48.86,66.69 arc45 48.94,66.87 AUDIO.4
N$39
  Top 0.406: C11.1 SERIAL.1
N$40
  Bottom 0.406: U$3.P$2 40.64,69.79 arc-45 40.71,69.97 41.91,71.17 50.25,71.17 arc-45 50.43,71.1 AUDIO.3
N$41
  Top 0.406: IC2.3 arc-45 97.02,70.08 100.36,70.08 100.69,70.41 arc-45 100.87,70.48 D5.A 116.15,70.48 arc-45 116.33,70.41 118.11,68.63 MIDI_IN.5
N$42
  Top 0.406: MIDI_IN.4 103.59,61.01 arc-45 103.41,61.08 102.72,61.77 102.72,62.58 arc45 R18.1
N$43
  Top 0.406: IC2.2 100.28,67.49 100.61,67.16 arc45 100.79,67.08 D5.C R18.2
N$46
  Top 0.406: IC2.7 86.66,67.49 arc-45 86.48,67.56 R16.2
N$52  (via drill 0.6)
  Top 0.406: R15.1 85.41,55.84 arc45 85.48,55.66 L10.A | DISP1.P$2 67.95,47.57 arc-45 68.02,47.75 71.12,50.85 v71.12,55.93
  Bottom 0.406: L10.A 84.86,56.29 71.58,56.29 arc45 71.4,56.21 v71.12,55.93
N$53
  Top 0.406: DISP1.P$3 65.38,44.52 65.38,45.69 63.5,47.57 63.5,53.39 62.23,54.66 L6.A 60.32,55.29 60.08,55.54 60.01,55.61 R11.1
N$54
  Top 0.406: R10.1 53.66,55.71 arc45 53.73,55.54 L5.A 57.71,51.56 arc-45 57.78,51.38 DISP1.P$6
N$55  (via drill 0.6)
  Top 0.406: v66.68,48.39 64.77,50.29 64.77,52.12 66.36,53.71 66.36,54.66 | 66.36,54.66 R12.1 | 66.36,54.66 L7.A
  Bottom 0.406: DISP1.P$9 65.41,41.32 arc-45 65.48,41.5 66.68,42.75 v66.68,48.39
N$56  (via drill 0.6)
  Top 0.406: R13.1 72.71,55.71 arc45 72.78,55.54 L8.A 74.83,54.66 arc-45 75,54.59 76.2,53.39 76.2,52.12 73.73,49.65 arc-45 73.56,49.58 72.39,49.58 v71.12,48.31
  Bottom 0.406: DISP1.P$8 67.95,41.32 arc-45 68.02,41.5 69.22,42.7 69.22,46.3 arc-45 69.29,46.48 v71.12,48.31
N$57  (via drill 0.6)
  Top 0.406: R14.1 79.06,55.71 arc45 79.13,55.54 L9.A v73.66,48.31
  Bottom 0.406: v73.66,48.31 73.66,31.9 arc-45 73.59,31.73 DISP1.P$7
N$58  (via drill 0.6)
  Top 0.406: R8.1 40.96,55.71 arc45 41.03,55.54 L3.A 44.45,52.12 44.45,49.58 45.72,48.31 v48.26,48.31
  Bottom 0.406: v48.26,48.31 48.26,43.23 60.25,31.24 arc-45 60.32,31.06 DISP1.P$11
N$59  (via drill 0.6)
  Top 0.406: R9.1 47.31,55.71 arc45 47.38,55.54 L4.A 49.42,54.66 arc-45 49.6,54.59 50.8,53.39 v50.8,48.31
  Bottom 0.406: v50.8,48.31 50.8,42.06 arc45 50.87,41.89 62.79,29.97 arc-45 62.87,29.79 DISP1.P$10
N$60
  Top 0.406: L9.K 78.85,52.12 arc45 78.67,52.05 76.2,49.58 76.2,43.33 arc45 76.27,43.16 77.47,41.96 78.85,41.96 arc45 TR3.C
  Bottom 0.406: L3.K L4.K L5.K L6.K L7.K L8.K L9.K 81.28,53.39 85.22,53.39 L10.K 86.31,52.19 arc-45 86.13,52.12
N$61  (via drill 0.6)
  Top 0.406: TR2.C 71.18,34.36 arc45 v71.12,34.34
  Bottom 0.406: v71.12,34.34 arc-45 71.08,34.36 70.51,34.92 70.51,44.44 arc45 DISP1.P$1
N$62  (via drill 0.6)
  Top 0.406: TR4.C 63.48,36.88 arc-45 63.3,36.95 v62.87,37.39
  Bottom 0.406: v62.87,37.39 DISP1.P$4
N$63  (via drill 0.6)
  Top 0.406: TR1.C 73.75,39.42 61.57,39.42 60.3,38.15 v60.32,38.15
  Bottom 0.406: v60.32,38.15 DISP1.P$5
N$64  (via drill 0.6)
  Top 0.406: TR5.C 58.4,31.8 arc45 58.22,31.73 v57.78,31.29
  Bottom 0.406: DISP1.P$12 v57.78,31.29
N$65
  Top 0.406: R21.2 81.56,40.69 arc-45 81.38,40.76 TR3.B
N$66
  Top 0.406: R22.2 85.2,38.15 arc-45 85.02,38.22 83.82,39.42 77.58,39.42 arc45 77.4,39.35 76.2,38.15 arc45 76.15,38.28 TR1.B
N$67
  Top 0.406: R63.2 81.54,35.61 arc-45 81.36,35.68 TR4.B
N$68
  Top 0.406: R23.2 85.2,33.07 arc-45 85.02,33.14 83.82,34.34 77.58,34.34 arc45 77.4,34.27 76.2,33.07 76.2,33.14 arc45 76.13,33.32 TR2.B
N$74
  Top 0.406: R24.2 81.51,30.55 arc-45 81.33,30.63 TR5.B
PULSE_IN  (via drill 0.6)
  Top 0.406: IC6.5 29.18,54.05 30.1,54.05 30.2,53.95 30.81,53.95 31.34,53.41 v31.37,53.41 | IC4.32 99.34,39.93 98.55,40.71 v96.52,40.71 | v74.93,45.77 73.66,44.5 73.66,41.96 72.39,40.69 48.26,40.69 44.45,44.5 38.1,44.5 v35.56,47.04
  Bottom 0.406: v31.37,53.41 31.75,53.03 31.75,50.85 v35.56,47.04 | v96.52,40.71 96.5,40.69 92.13,40.69 89.61,43.2 77.5,43.2 v74.93,45.77
PULSE_OUT  (via drill 0.6)
  Top 0.406: IC6.1 37.04,50.21 arc45 37.22,50.29 R7.1 38.1,46.89 39.47,45.52 44.7,45.52 48.64,41.58 71.81,41.58 72.75,42.52 72.75,45.64 74.17,47.06 74.85,47.06 v74.88,47.04 | IC4.2 100.78,41.2 98.98,41.2 98.25,41.93 v95.25,41.93
  Bottom 0.406: v95.25,41.93 95.23,41.96 92.71,41.96 90.83,43.84 78.23,43.84 75.03,47.04 v74.88,47.04
RESET  (via drill 0.6)
  Top 0.406: 116.84,34.02 C11.2 | 116.84,34.02 116.84,33.07 118.11,31.8 R25.2 | 116.84,34.02 116.52,34.34 114.3,34.34 | IC4.29 96.95,35.1 97.71,34.34 v99.34,34.34 114.3,34.34 | 114.3,34.34 RESET.1 RESET.2 | v83.31,46.53 ICSP.5 | v79.76,46.53 79.76,45.26 81.03,43.99 82.55,43.99 83.06,43.48 v83.06,42.21
  Bottom 0.406: v99.34,34.34 97.36,34.34 89.48,42.21 v83.06,42.21 | v79.76,46.53 v83.31,46.53
RXD  (via drill 0.6)
  Top 0.406: IC2.6 96.13,63.18 arc-45 96.2,63 R17.1 100.33,58.15 v100.33,49.58 | SERIAL.3 123.65,39.42 124.46,38.61 124.46,36.4 123.67,35.61 120.09,35.61 119.71,35.99 102.87,35.99 v100.33,35.99 98.63,35.99 97.75,36.87 IC4.30
  Bottom 0.406: v100.33,35.99 v100.33,49.58
SEG0  (via drill 0.6)
  Top 0.406: R8.2 v44.45,57.2 | IC4.9 99.35,56.81 arc45 99.27,56.99 v99.06,57.2
  Bottom 0.406: v99.06,57.2 94.64,61.62 48.87,61.62 v44.45,57.2
SEG1  (via drill 0.6)
  Top 0.406: R9.2 v50.8,57.2 | IC4.10 98.55,56.34 arc45 98.47,56.52 v97.79,57.2
  Bottom 0.406: v97.79,57.2 arc-45 97.75,57.22 94.01,60.96 55.88,60.96 55.55,60.96 54.56,60.96 v50.8,57.2
SEG2  (via drill 0.6)
  Top 0.406: R10.2 v57.15,57.2 | IC4.11 97.75,55.87 arc45 97.67,56.05 v96.52,57.2
  Bottom 0.406: v96.52,57.2 arc-45 96.48,57.22 93.42,60.27 63.5,60.27 62.49,60.27 60.22,60.27 v57.15,57.2
SEG3  (via drill 0.6)
  Top 0.406: R11.2 v63.5,57.2 | IC4.12 96.95,55.4 arc45 96.87,55.58 v95.25,57.2
  Bottom 0.406: v95.25,57.2 92.81,59.64 65.94,59.64 v63.5,57.2
SEG4  (via drill 0.6)
  Top 0.406: R12.2 v69.85,57.2 | IC4.13 96.15,54.93 arc45 96.07,55.11 v93.98,57.2
  Bottom 0.406: v93.98,57.2 92.18,59 71.65,59 v69.85,57.2
SEG5  (via drill 0.6)
  Top 0.406: IC4.14 95.35,54.46 arc45 95.27,54.64 v92.71,57.2 | R13.2 v76.2,57.2
  Bottom 0.406: v92.71,57.2 91.57,58.34 77.34,58.34 v76.2,57.2
SEG6  (via drill 0.6)
  Top 0.406: IC4.15 94.55,53.99 arc45 94.47,54.17 v91.44,57.2 | R14.2 v82.55,57.2 82.55,52.12 82.04,51.61 ICSP.4
  Bottom 0.406: v82.55,57.2 v91.44,57.2
SEG7
  Top 0.406: R15.2 90.17,57.2 93.67,53.7 arc-45 93.75,53.52 IC4.16 93.75,49.31 93.73,49.33 90.68,49.33 86.11,44.75 81.53,44.75 80.77,45.52 ICSP.1
SW_READ
  Top 0.406: IC4.28 96.11,38.93 96.11,27.79 97.18,26.72 100.33,26.72 103.43,23.62 105.28,23.62 S5.3 | S3.3 35.53,38.15 40.64,38.15 R26.2 | S4.4 S4.3
  Bottom 0.406: S1.3 19,24.23 19.05,24.18 | S1.3 S2.4 S2.3 35.51,24.18 36.83,24.18 39.37,21.64 91.44,21.64 92.81,23.01 S5.4 104.12,23.6 104.14,23.62 106.66,23.62 106.68,23.6 | S3.4 S3.3 16.43,38.07 15.24,36.88 15.24,24.18 | 106.68,23.6 S5.3 | 106.68,23.6 S4.4 | S1.3 18.9,24.18 15.24,24.18 | 15.24,24.18 6.5,24.18 S1.4
TXD  (via drill 0.6)
  Top 0.406: 48.26,30.53 IC1.14 | 48.26,27.99 IC1.5 | 48.26,25.45 IC1.7 | 48.26,30.53 IC1.3 | 48.26,27.99 48.26,30.53 | 48.26,25.45 48.26,26.72 | 48.26,26.72 48.26,27.99 | 48.26,26.72 IC1.11 | 48.26,25.45 48.26,24.18 IC1.9 50.8,24.18 52.07,22.91 v52.07,11.48 | IC4.31 98.53,38.94 98.53,37.16 98.81,36.88 v111.76,36.88 SERIAL.2
  Bottom 0.406: v111.76,36.88 111.76,15.29 105.41,8.94 53.34,8.94 52.07,10.21 v52.07,11.48
VCC  (via drill 0.6)
  Top 0.406: IC6.8 28.45,50.21 28.33,50.1 arc45 28.26,49.92 R6.2 28.01,48.56 arc45 27.84,48.63 C3.1 26.28,48.52 arc-45 26.35,48.34 26.35,48.09 arc-45 26.28,47.92 25.4,47.04 22.96,47.04 arc-45 22.79,47.11 21.59,48.31 R3.2 13.75,48.63 arc-45 13.58,48.7 12.7,49.58 IC5.3 | 93.98,62.28 R17.2 91.71,64.87 arc45 91.53,64.95 IC2.8 | R34.2 77.28,10.02 76.2,8.94 | R32.2 57.72,10.1 56.57,8.94 | R28.2 18.23,9.87 17.3,8.94 | 99.06,44.45 95.52,44.45 94.74,45.24 92.27,45.24 IC4.18 v90.22,45.26 88.27,45.26 87.8,44.79 R20.1 | 99.06,44.45 IC4.6 100.88,44.5 105.41,44.5 106.36,43.55 C8.2 106.68,43.23 107.95,41.96 v115.57,41.96 | IC4.4 99.44,42.85 99.06,43.23 99.06,44.45 | R30.2 38.1,20.5 38.1,8.94 | 93.98,62.28 C7.2 | 93.98,62.28 94.26,62 94.26,59.16 94.06,58.95 84.25,58.95 83.52,58.22 v83.52,52.3 | R36.2 92.71,20.37 91.44,19.1 91.44,8.94 | 125.73,20.37 R38.2 | v125.73,31.8 R25.1 | v80.77,50.44 ICSP.2
  Top 0.813: C1.1 11.75,51.9 arc45 11.82,51.73 IC5.3 12.7,45.87 arc-45 12.63,45.7 7.62,40.69 7.62,33.07 | 7.62,33.07 C6.+ 2.54,30.53 2.54,12.75 6.35,8.94 17.3,8.94 38.1,8.94 56.57,8.94 76.2,8.94 91.44,8.94 124.46,8.94 125.73,10.21 125.73,20.37 v125.73,31.8 JP1.1 | 7.62,33.07 IC1.1
  Bottom 0.406: v90.22,45.26 86.87,45.26 86.36,45.77 86.36,49.83 83.9,52.3 v83.52,52.3 82.63,52.3 v80.77,50.44
  Bottom 0.813: v125.73,31.8 119.38,31.8 116.84,34.34 116.84,40.69 v115.57,41.96

### Text on the board
tPlace: 1